# EAGLE schematic powerSupply (EAGLE 7.2.0)
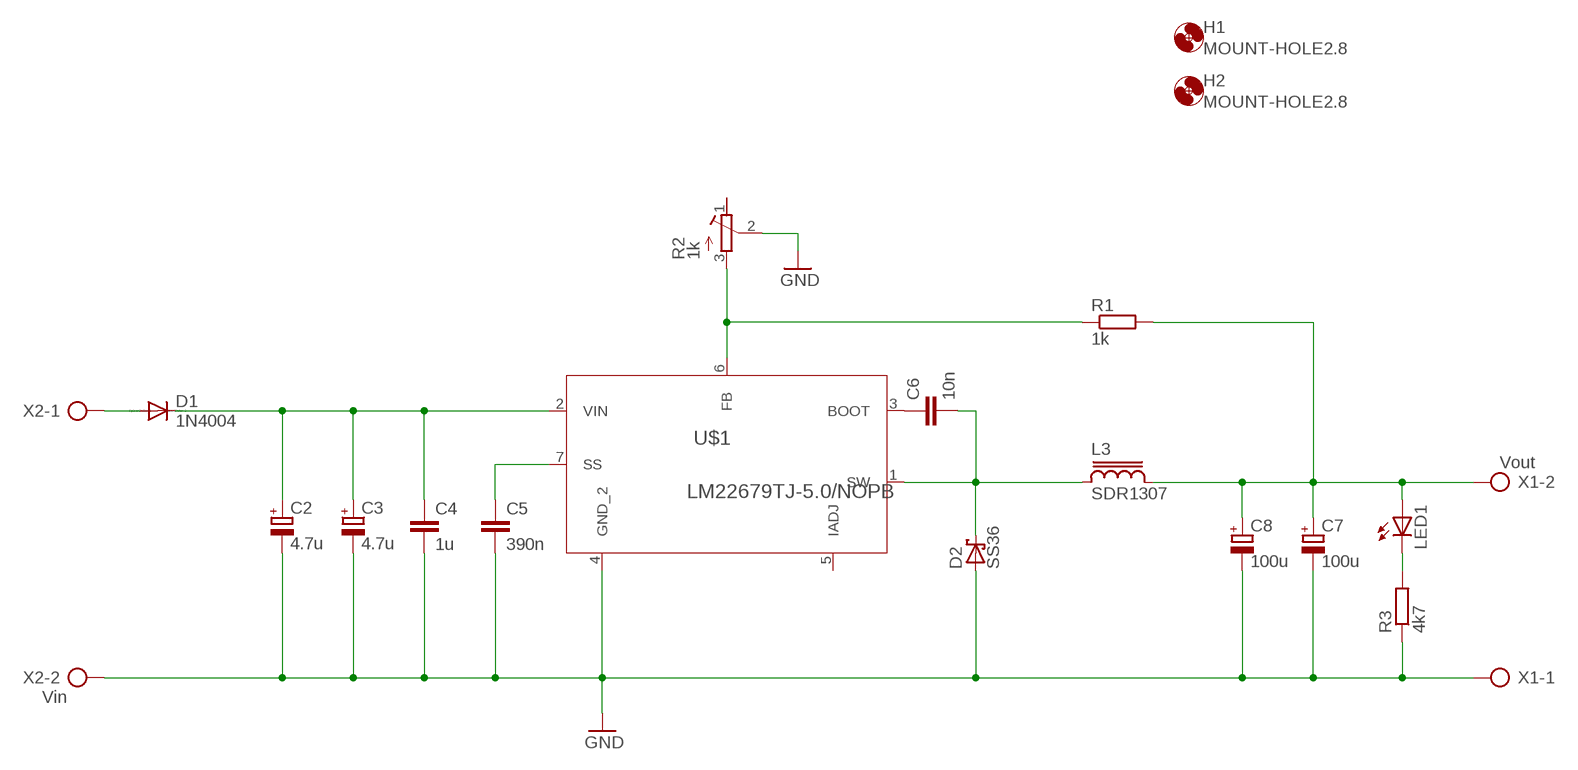
[diagram p0: schematic, sheet 1]

## Parts
C2  4.7u  CPOL-EUE2.5-5  [E2,5-5]
C3  4.7u  CPOL-EUE2.5-5  [E2,5-5]
C4  1u  C-EUC1206  [C1206]
C5  390n  C-EUC0603  [C0603]
C6  10n  C-EUC0805  [C0805]
C7  100u  CPOL-EUD  [PANASONIC_D]
C8  100u  CPOL-EUD  [PANASONIC_D]
D1  1N4004  [DO41-10]
D2  SS36  SCHOTTKY-DIODESMC  [SMC]
H1  MOUNT-HOLE2.8  [2,8]
H2  MOUNT-HOLE2.8  [2,8]
L3  SDR1307  [SDR1307]
LED1  LEDCHIPLED_1206  [CHIPLED_1206]
R1  1k  R-EU_R1206  [R1206]
R2  1k  R-TRIMM3314J  [RTRIM3314J]
R3  4k7  R-EU_R1206  [R1206]
U$1  LM22679TJ-5.0/NOPB  [TJ7A]
X1  Vout  AK500/2  [AK500/2]
X2  Vin  AK500/2  [AK500/2]

## Nets
GND: C2.- C3.- C4.2 C5.2 C7.- C8.- D2.A R2.2(S) R3.1 U$1.4(GND_2) X1.1 X2.2
N$1: R1.1 R2.3(A) U$1.6(FB)
N$2: C6.1 U$1.3(BOOT)
N$3: D1.A X2.1
N$4: C2.+ C3.+ C4.1 D1.C U$1.2(VIN)
N$5: LED1.C R3.2
N$6: C5.1 U$1.7(SS)
VIN: C6.2 D2.C L3.1 U$1.1(SW)
VOUT: C7.+ C8.+ L3.2 LED1.A R1.2 X1.2
Unconnected: R2.1(E) U$1.5(IADJ)

## Library data of the parts
C2 C3 C7 C8 = rcl:CPOL-EU: POLARIZED CAPACITOR, European symbol
C4-C6 = rcl:C-EU: CAPACITOR, European symbol
D1 = diode:1N4004: DIODE general purpose rectifier, 1 A
D2 = diode:SCHOTTKY-DIODE: Schottky Diode
H1 H2 = holes:MOUNT-HOLE: MOUNTING HOLE with drill center marker
L3 = inductor-bourns:SDR1307: POWER INDUCTOR
LED1 = led:LED: LED OSRAM: - CHIPLED LG R971, LG N971, LY N971, LG Q971, LY Q971, LO R971, LY R971 LH N974, LH R974 LS Q976, LO Q976, LY Q976 LO Q996 - Hyper CHIPLED LW Q18S LB Q993, LB Q99A, LB R99A - SideLED LS A670, LO A670, LY A670, LG A670, LP A670 LB A673, LV A673, LT A673, LW A673 LH A674 LY A675 LS A676, LA A676, LO A676, LY A676, LW A676 LS A679, LY A679, LG A679 - Hyper Micro SIDELED® LS Y876, LA Y876, LO Y876, LY Y876 LT Y87S - SmartLED LW L88C, LW L88S LB L89C, LB L89S, LG L890 LS L89K, LO L89K, LY L89K LS L896, LA L896, LO L896, LY L896 - TOPLED LS T670, LO T670, LY T670, LG T670, LP T670 LSG T670, LSP T670, LSY T670, LOP T670, LYG T670 LG T671, LOG T671, LSG T671 LB T673, LV T673, LT T673, LW T673 LH T674 LS T676, LA T676, LO T676, LY T676, LB T676, LH T676, LSB T676, LW T676 LB T67C, LV T67C, LT T67C, LS T67K, LO T67K, LY T67K, LW E67C LS E67B, LA E67B, LO E67B, LY E67B, LB E67C, LV E67C, LT E67C LW T67C LS T679, LY T679, LG T679 LS T770, LO T770, LY T770, LG T770, LP T770 LB T773, LV T773, LT T773, LW T773 LH T774 LS E675, LA E675, LY E675, LS T675 LS T776, LA T776, LO T776, LY T776, LB T776 LHGB T686 LT T68C, LB T68C - Hyper Mini TOPLED® LB M676 - Mini TOPLED Santana® LG M470 LS M47K, LO M47K, LY M47K Source: http://www.osram.convergy.de LUXEON: - LUMILED® LXK2-PW12-R00, LXK2-PW12-S00, LXK2-PW14-U00, LXK2-PW14-V00 LXK2-PM12-R00, LXK2-PM12-S00, LXK2-PM14-U00 LXK2-PE12-Q00, LXK2-PE12-R00, LXK2-PE12-S00, LXK2-PE14-T00, LXK2-PE14-U00 LXK2-PB12-K00, LXK2-PB12-L00, LXK2-PB12-M00, LXK2-PB14-N00, LXK2-PB14-P00, LXK2-PB14-Q00 LXK2-PR12-L00, LXK2-PR12-M00, LXK2-PR14-Q00, LXK2-PR14-R00 LXK2-PD12-Q00, LXK2-PD12-R00, LXK2-PD12-S00 LXK2-PH12-R00, LXK2-PH12-S00 LXK2-PL12-P00, LXK2-PL12-Q00, LXK2-PL12-R00 Source: www.luxeon.com KINGBRIGHT: KA-3528ASYC Source: www.kingbright.com
R1 R3 = rcl:R-EU_: RESISTOR, European symbol
R2 = resistor:R-TRIMM: Trimm resistor
U$1 = untitled:LM22679TJ-5.0/NOPB; DATASHEETURL: http://www.ti.com/product/lm22679; FREQUENCY: 500000.0; IMAX: 5.0; MANUFACTURER_NAME: Texas Instruments; MANUFACTURER_PART_NUMBER: LM22679TJ-5.0/NOPB; MKTG_PACKAGE: NA; NSID: LM22679TJ-5.0/NOPB; PACKAGE: NA; VENDOR: Texas Instruments
X1 X2 = con-ptr500:AK500/2: CONNECTOR; OC_FARNELL: unknown; OC_NEWARK: unknown